# Altium schematic sheet Sheet1.SchDoc
size A3; SheetNumber: 1; SheetTotal: 1
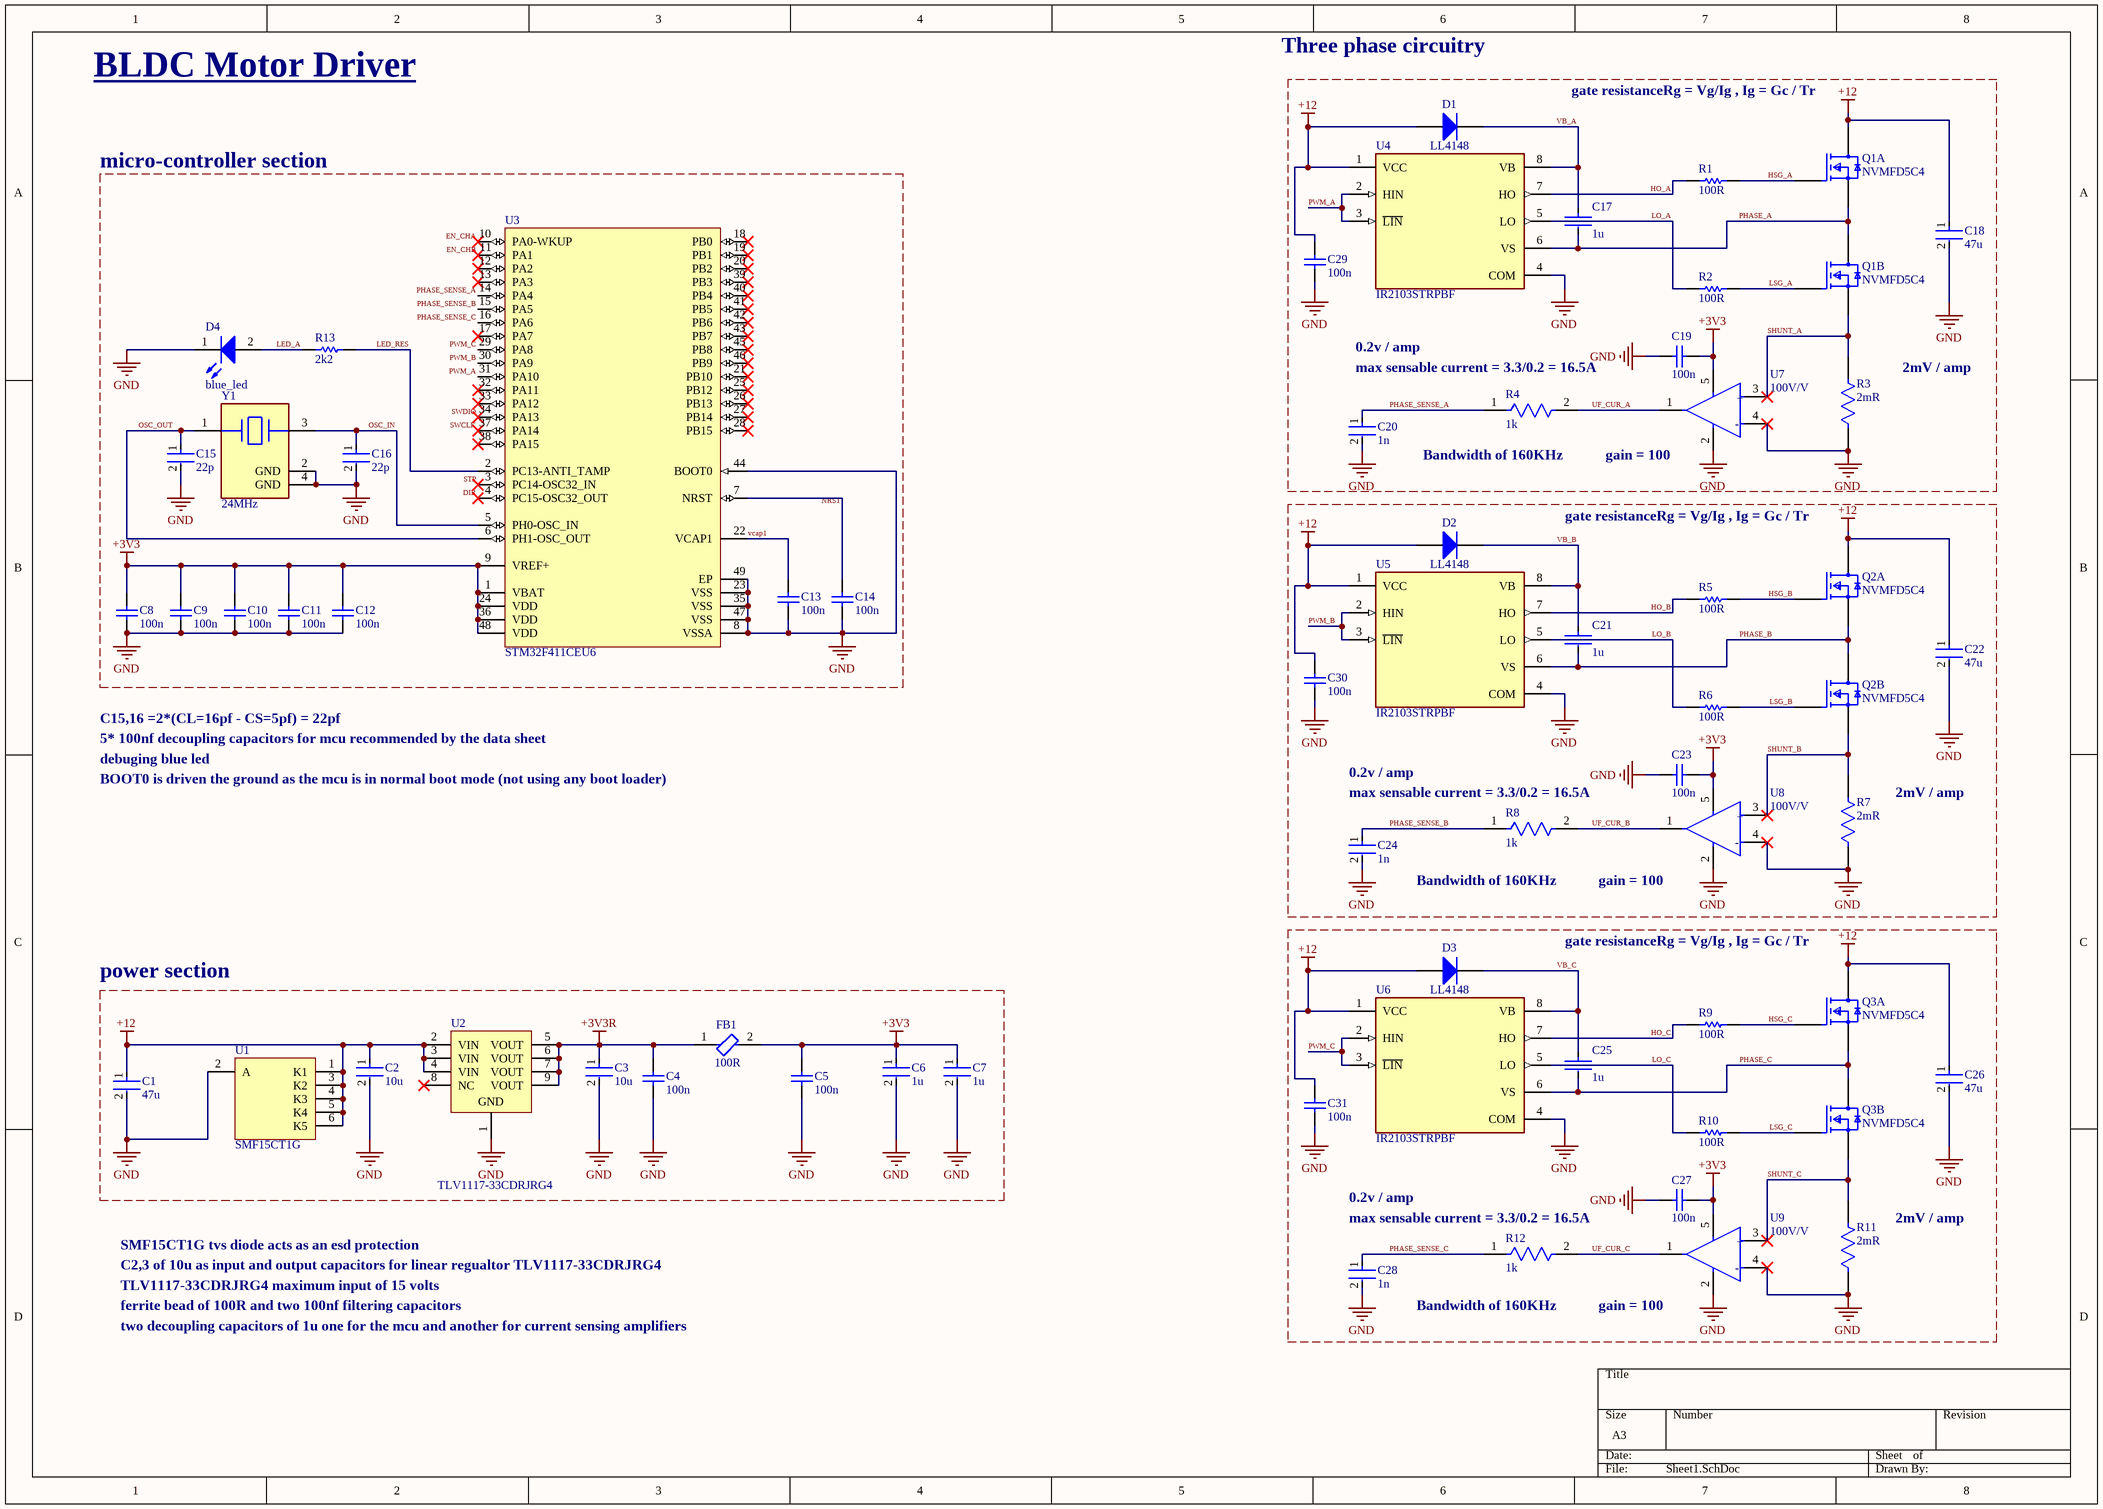
[diagram p0: Sheet1.SchDoc]

## Parts
C1  47u  [FP-C3216-160-0_2-MFG]
C2  10u  [FP-GRM21B-0_1-IPC_C]
C3  10u  [FP-GRM21B-0_1-IPC_C]
C4  100n  [CAPC1005X56X25LL10T15]
C5  100n  [CAPC1005X56X25LL10T15]
C6  1u  [FP-CC0402-MFG]
C7  1u  [FP-CC0402-MFG]
C8  100n  [CAPC1005X56X25LL10T15]
C9  100n  [CAPC1005X56X25LL10T15]
C10  100n  [CAPC1005X56X25LL10T15]
C11  100n  [CAPC1005X56X25LL10T15]
C12  100n  [CAPC1005X56X25LL10T15]
C13  100n  [CAPC1005X56X25LL10T15]
C14  100n  [CAPC1005X56X25LL10T15]
C15  22p  [FP-C0402-BB-MFG]
C16  22p  [FP-C0402-BB-MFG]
C17  1u  [FP-CC0402-MFG]
C18  47u  [FP-C3216-160-0_2-MFG]
C19  100n  [CAPC1005X56X25LL10T15]
C20  1n  [FP-GRM155-0_05-IPC_B]
C21  1u  [FP-CC0402-MFG]
C22  47u  [FP-C3216-160-0_2-MFG]
C23  100n  [CAPC1005X56X25LL10T15]
C24  1n  [FP-GRM155-0_05-IPC_B]
C25  1u  [FP-CC0402-MFG]
C26  47u  [FP-C3216-160-0_2-MFG]
C27  100n  [CAPC1005X56X25LL10T15]
C28  1n  [FP-GRM155-0_05-IPC_B]
C29  100n  [CAPC1005X56X25LL10T15]
C30  100n  [CAPC1005X56X25LL10T15]
C31  100n  [CAPC1005X56X25LL10T15]
D1  LL4148  [FAIR-SOD80-2_V]
D2  LL4148  [FAIR-SOD80-2_V]
D3  LL4148  [FAIR-SOD80-2_V]
D4  blue_led  [WL-SMCC_0402_L1W0.5H0.4]
FB1  100R  [FP-MPZ2012-MFG]
Q1  NVMFD5C4  [FP-506BT-MFG]  (parts A,B of 2)
Q2  NVMFD5C4  [FP-506BT-MFG]  (parts A,B of 2)
Q3  NVMFD5C4  [FP-506BT-MFG]  (parts A,B of 2)
R1  100R  [RESC1005X40X25ML05T10]
R2  100R  [RESC1005X40X25ML05T10]
R3  2mR  [FP-CSS2H-2512K-2L00F-MFG]
R4  1k  [FP-RC0402-0_4-IPC_A]
R5  100R  [RESC1005X40X25ML05T10]
R6  100R  [RESC1005X40X25ML05T10]
R7  2mR  [FP-CSS2H-2512K-2L00F-MFG]
R8  1k  [FP-RC0402-0_4-IPC_A]
R9  100R  [RESC1005X40X25ML05T10]
R10  100R  [RESC1005X40X25ML05T10]
R11  2mR  [FP-CSS2H-2512K-2L00F-MFG]
R12  1k  [FP-RC0402-0_4-IPC_A]
R13  2k2  [RESC1005X40X25NL5T10]
U1  SMF15CT1G  [ONSC-SC70-6-419B-02_W_V]
U2  TLV1117-33CDRJRG4  [DRJ8-3000X2200TP]
U3  STM32F411CEU6  [STM-UFQFPN48_L]
U4  IR2103STRPBF  [FP-PG-DSO-8-MFG]
U5  IR2103STRPBF  [FP-PG-DSO-8-MFG]
U6  IR2103STRPBF  [FP-PG-DSO-8-MFG]
U7  100V/V  [FP-DBV0005A-IPC_C]
U8  100V/V  [FP-DBV0005A-IPC_C]
U9  100V/V  [FP-DBV0005A-IPC_C]
Y1  24MHz  [FP-ABM3B-MFG]

## Blocks framed on the sheet
micro-controller section: C8-C16 D4 R13 U3 Y1
power section: C1-C7 FB1 U1 U2

## Nets
+3V3: C5.2 C6.1 C7.1 C8.2 C9.2 C10.2 C11.2 C12.2 C19.1 C23.1 C27.1 FB1.2 U3.1(VBAT) U3.9(VREF+) U3.24(VDD) U3.36(VDD) U3.48(VDD) U7.5(VS) U8.5(VS) U9.5(VS)
+3V3R: C3.1 C4.2 FB1.1 U2.5(VOUT) U2.6(VOUT) U2.7(VOUT) U2.9(VOUT)
+12: C1.1 C2.1 C18.1 C22.1 C26.1 C29.2 C30.2 C31.2 D1.1(A) D2.1(A) D3.1(A) Q1.7-8(D1) Q2.7-8(D1) Q3.7-8(D1) U1.1(K1) U1.3(K2) U1.4(K3) U1.5(K4) U1.6(K5) U2.2(VIN) U2.3(VIN) U2.4(VIN) U4.1(VCC) U5.1(VCC) U6.1(VCC)
GND: C1.2 C2.2 C3.2 C4.1 C5.1 C6.2 C7.2 C8.1 C9.1 C10.1 C11.1 C12.1 C13.1 C14.1 C15.2 C16.2 C18.2 C19.2 C20.2 C22.2 C23.2 C24.2 C26.2 C27.2 C28.2 C29.1 C30.1 C31.1 D4.1(K) R3.1 R7.1 R11.1 U1.2(A) U2.1(GND) U3.8(VSSA) U3.23(VSS) U3.35(VSS) U3.44(BOOT0) U3.47(VSS) U3.49(EP) U4.4(COM) U5.4(COM) U6.4(COM) U7.2(GND) U7.4(IN-) U8.2(GND) U8.4(IN-) U9.2(GND) U9.4(IN-) Y1.2(GND) Y1.4(GND)
DIR: U3.4(PC15-OSC32_OUT)
EN_CHA: U3.10(PA0-WKUP)
EN_CHB: U3.11(PA1)
HO_A: R1.1 U4.7(HO)
HO_B: R5.1 U5.7(HO)
HO_C: R9.1 U6.7(HO)
HSG_A: Q1.2(G1) R1.2
HSG_B: Q2.2(G1) R5.2
HSG_C: Q3.2(G1) R9.2
LED_A: D4.2(A) R13.1
LED_RES: R13.2 U3.2(PC13-ANTI_TAMP)
LO_A: R2.1 U4.5(LO)
LO_B: R6.1 U5.5(LO)
LO_C: R10.1 U6.5(LO)
LSG_A: Q1.4(G2) R2.2
LSG_B: Q2.4(G2) R6.2
LSG_C: Q3.4(G2) R10.2
NRST: C14.2 U3.7(NRST)
OSC_IN: C16.1 U3.5(PH0-OSC_IN) Y1.3
OSC_OUT: C15.1 U3.6(PH1-OSC_OUT) Y1.1
PHASE_A: C17.2 Q1.1(S1) Q1.5-6(D2) U4.6(VS)
PHASE_B: C21.2 Q2.1(S1) Q2.5-6(D2) U5.6(VS)
PHASE_C: C25.2 Q3.1(S1) Q3.5-6(D2) U6.6(VS)
PHASE_SENSE_A: C20.1 R4.1 U3.14(PA4)
PHASE_SENSE_B: C24.1 R8.1 U3.15(PA5)
PHASE_SENSE_C: C28.1 R12.1 U3.16(PA6)
PWM_A: U3.31(PA10) U4.2(HIN) U4.3(~{LIN})
PWM_B: U3.30(PA9) U5.2(HIN) U5.3(~{LIN})
PWM_C: U3.29(PA8) U6.2(HIN) U6.3(~{LIN})
SHUNT_A: Q1.3(S2) R3.2 U7.3(IN+)
SHUNT_B: Q2.3(S2) R7.2 U8.3(IN+)
SHUNT_C: Q3.3(S2) R11.2 U9.3(IN+)
STP: U3.3(PC14-OSC32_IN)
SWCLK: U3.37(PA14)
SWDIO: U3.34(PA13)
UF_CUR_A: R4.2 U7.1(OUT)
UF_CUR_B: R8.2 U8.1(OUT)
UF_CUR_C: R12.2 U9.1(OUT)
VB_A: C17.1 D1.2(K) U4.8(VB)
VB_B: C21.1 D2.2(K) U5.8(VB)
VB_C: C25.1 D3.2(K) U6.8(VB)
vcap1: C13.2 U3.22(VCAP1)

Not connected (* = marked no-connect by the designer): U2 8(NC)*; U3 12(PA2)* 13(PA3)* 17(PA7)* 18(PB0)* 19(PB1)* 20(PB2)* 21(PB10)* 25(PB12)* 26(PB13)* 27(PB14)* 28(PB15)* 32(PA11)* 33(PA12)* 38(PA15)* 39(PB3)* 40(PB4)* 41(PB5)* 42(PB6)* 43(PB7)* 45(PB8)* 46(PB9)*

## Notes on the sheet
- BLDC Motor Driver
- Three phase circuitry
- gate resistanceRg = Vg/Ig , Ig = Gc / Tr
- 0.2v / amp
- max sensable current = 3.3/0.2 = 16.5A
- 2mV / amp
- (near R4) Bandwidth of 160KHz
- (near U7) gain = 100
- C15,16 =2*(CL=16pf - CS=5pf) = 22pf
- 5* 100nf decoupling capacitors for mcu recommended by the data sheet
- debuging blue led
- BOOT0 is driven the ground as the mcu is in normal boot mode (not using any boot loader)
- (near R7) 2mV / amp
- Bandwidth of 160KHz
- (near U8) gain = 100
- SMF15CT1G tvs diode acts as an esd protection
- (near R11) 2mV / amp
- C2,3 of 10u as input and output capacitors for linear regualtor TLV1117-33CDRJRG4
- TLV1117-33CDRJRG4 maximum input of 15 volts
- ferrite bead of 100R and two 100nf filtering capacitors
- (near U9) gain = 100
- two decoupling capacitors of 1u one for the mcu and another for current sensing amplifiers
- (in symbol CMP-04895-000229-1) +; -

## Library data of the parts
C1 C18 C22 C26 = CMP-2000-05397-3: Multilayer Ceramic Capacitors 47uF ±20% 25V X5R SMD 1206; Weight: 0.000571oz; Dielectric: X5R; Length: 0.126inch; Voltage Rating: 25V; Case/Package: 1206; Dielectric Material: Ceramic; Min Operating Temperature: -55°C; Lead Free: Lead Free; Packaging: Tape and Reel; Package Quantity: 1; Mount: Surface Mount; Depth: 1.6mm; REACH SVHC: No SVHC; Termination: SMD/SMT; Case Code (Imperial): 1206; Series: C; Resistor Type: Ceramic; Voltage: 25V; Width: 0.063inch; Height: 1.6mm; Tolerance: 20%; Capacitance: 47uF; Max Operating Temperature: 85°C; Voltage Rating (DC): 25V; RoHS Compliant: Yes; Thickness: 0.071inch; Case Code (Metric): 3216
C2 C3 = CMP-2007-03453-2: Chip Multilayer Ceramic Capacitors for General Purpose, 0805, 10uF, X5R, 15%, 10%, 16V; Radiation Hardening: No; Thickness: 0.053inch; Voltage Rating (DC): 16V; Lead Free: Lead Free; Package Quantity: 1; Width: 1.25mm; Case Code (Imperial): 0805; Depth: 1.25mm; Packaging: Tape and Reel; Dielectric: X5R; Max Operating Temperature: 85°C; Tolerance: 10%; Voltage Rating: 16V; Voltage: 16V; Capacitance: 10uF; Height: 1.25mm; Case Code (Metric): 2012; Material: Ceramic; Mount: Surface Mount; Case/Package: 0805; REACH SVHC: No SVHC; Length: 2mm; Min Operating Temperature: -55°C; Termination: SMD/SMT
C4 C5 C8-C14 C19 C23 C27 C29-C31 = CMP-2008-02743-1: Manufacturer: AVX Interconnect / Elco; Part Number: 04026D104KAT2A
C6 C7 C17 C21 C25 = CMP-2100-03591-2: CAP CER 1UF 6.3V X5R 0402; Manufacturer: YAGEO; Manufacturer Part Number: CC0402KRX5R5BB105; Automotive Grade: NA; Material: Ceramic; Tolerance: 0.1; Temperature Coefficient: 30ppm/°C; Voltage Rating: 6.3 V; Temperature Range Low: -55°C; Digikey Description: CAP CER 1UF 6.3V X5R 0402; Capacitance: 1 uF; Height: 0.55mm; Automotive: No; ComponentLink2URL: http://www.yageo.com/documents/recent/UPY-GP_NP0_16V-to-50V_16.pdf; Device Class L2: Capacitors; RoHS: TRUE; Temperature Range High: +125°C; Device Class L3: Ceramic Capacitors; Device Class L1: Passive Components; Temperature Characteristic: X5R; Package: CC0402; Octopart: https://octopart.com/cc0402krx5r5bb105-yageo-42244618; ComponentLink2Description: Datasheet; Temperature: -55°C to +125°C; Mouser Description: Multilayer Ceramic Capacitors MLCC - SMD/SMT 1uF 6.3V X5R 10%; Category: Cap; Footprint Url: http://www.yageo.com/exep/pages/download/literatures/UPY-C_GEN_24.pdf; Lead Free: Yes; Ipc Land Pattern Name: CAPC10050X50; Value: 1 uF
C15 C16 = CMP-2008-03360-2: CAP CER 22PF 16V 5% NP0 0402; Manufacturer: Kemet; Manufacturer Part Number: C0402C220J4GACTU; Tolerance: 0.05; Temperature Coefficient: 15%; Material: Ceramic; Temperature Characteristic: C0G; RoHS: TRUE; Device Class L2: Capacitors; Digikey Description: CAP CER 22PF 16V 5% NP0 0402; Mouser Description: Multilayer Ceramic Capacitors MLCC - SMD/SMT 16volts 22pF C0G 5%; Height: 0.55mm; Ipc Land Pattern Name: CAPC10050X50; Octopart: https://octopart.com/c0402c220j4gactu-kemet-9139401; Lead Free: Yes; Category: Cap; Capacitance: 22 pF; Temperature Range High: +125°C; ComponentLink2URL: https://content.kemet.com/datasheets/KEM_C1002_X7R_SMD.pdf; Device Class L3: Ceramic Capacitors; Package: C0402-BB; Temperature: -55°C to +125°C; Automotive: No; Device Class L1: Passive Components; Voltage Rating: 16 V; Value: 22 pF; ComponentLink2Description: Datasheet; Temperature Range Low: -55°C
C20 C24 C28 = CMP-2008-04254-2: Chip Multilayer Ceramic Capacitors for General Purpose, 0402, 1000pF, C0G, 30ppm/°C, 5%, 50V; Insulation Resistance: 10GR; Capacitance: 1nF; Packaging: Tape and Reel; Lead Free: Lead Free; Tolerance: 5%; Temperature Coefficient: 30ppm/°C; Thickness: 0.022inch; Termination: SMD/SMT; Max Operating Temperature: 125°C; Height: 0.5mm; Package Quantity: 1; Radiation Hardening: No; Material: Ceramic; Case Code (Metric): 1005; Number of Pins: 2; Voltage Rating: 50V; Mount: Surface Mount; Voltage: 50V; Case/Package: 0402; Min Operating Temperature: -55°C; Dielectric Material: Ceramic; Width: 0.5mm; Depth: 0.5mm; Case Code (Imperial): 0402; REACH SVHC: No SVHC; Dielectric: C0G; Voltage Rating (DC): 50V; Length: 1mm
D1-D3 = CMP-2000-05115-2: Small Signal Diode, 100 V, 0.2 A, -55 to 175 degC, 2-Pin SOD80, RoHS, Tape and Reel; Manufacturer: Fairchild; Reverse Voltage-Max [Vrrm]: 100V; Average Forward Current-Max: 200mA; Forward Voltage: 1V; Reverse Recovery Time-Max: 1ns; Power Dissipation: 500mW; Datasheet URL: https://www.fairchildsemi.com/datasheets/LL/LL4148.pdf; Manufacturer URL: https://www.fairchildsemi.com/; Datasheet Version: Rev. 1.8, 01/2016
D4 = CMP-03913-90235556-2: WL-SMCC SMT Mono-Color Chip LED Compact; Viewing Angle: 120°; Max Reverse Voltage (DC): 5V; Luminous Intensity: 150mcd; Wavelength: 470nm; Peak Wavelength: 465nm; Forward Voltage: 3.2V; Forward Current: 60mA; Min Operating Temperature: -40°C; Width: 500µm; Length: 1mm; Packaging: Tape and Reel; RoHS: Compliant; Dominant Wavelength: 470nm; Max Operating Temperature: 85°C; Height: 400µm
FB1 = CMP-2000-05401-2: Manufacturer Lifecycle Status: PRODUCTION; NexarPartId: 12090955; RMS Current (Irms): 2A; Test Frequency: 100MHz; Tolerance: 25%; Core Material: Ferrite; Series Resistance: 100mΩ; Impedance: 600Ω; Packaging: Digi-Reel®; Length: 2mm; Min Operating Temperature: -55°C; Width: 1.25mm; Max Width: 1.45mm; Lead Free: Lead Free; Current Rating: 2A; Case Code (Imperial): 0805; Min Length: 1.8mm; Schedule B: 8504500000, 8504500000; REACH SVHC: No SVHC; Case Code (Metric): 2012; Max DC Current: 2A; Case/Package: 0805; Lifecycle Status: Production; Min Width: 1.05mm; Mount: Surface Mount; Height: 1.0414mm; Resistance: 100mΩ; DC Resistance (DCR): 100mΩ; Max Operating Temperature: 125°C; Max Length: 2.2mm; RoHS: Compliant
Q1-Q3 = CMP-00278-84330944-1: NVMFD5C470NLWFT1G Trans MOSFET Array Dual N-CH 40V 11A 8-Pin SOIC-FL T/R; Manufacturer Lifecycle Status: ACTIVE; Drain to Source Resistance: 9.2mΩ; Lifecycle Status: Production; Schedule B: 8541290080; RoHS: Compliant; NexarPartId: 84330944
R1 R2 R5 R6 R9 R10 = CMP-2002-07344-1: Part Number: RC0402FR-07100RL; Manufacturer: Yageo / Phycomp
R3 R7 R11 = CMP-00059-73869590-1: CSS2H-2512K-2L00F SMD Current Sense Resistor, 2 Milliohm, ± 1%, 5 W, 2512 [6432 Metric], Metal Strip; Max Power Dissipation: 5W; Resistance: 2mΩ; Temperature Coefficient: 50ppm/°C; REACH SVHC: No SVHC; Tolerance: 1%; Height: 508µm; Case/Package: 2512; Length: 6.35mm; Packaging: Cut Tape; Number of Terminations: 2; Power Rating: 5W; Case Code (Imperial): 2512; RoHS: Compliant; Min Operating Temperature: -55°C; NexarPartId: 73869590; Features: Moisture Resistant; Max Operating Temperature: 170°C; Composition: Metal Element; Schedule B: 8533210045, 8533210045; Case Code (Metric): 6432; Width: 3.048mm
R4 R8 R12 = CMP-2002-07472-3: RES 1K OHM 1% 1/16W 0402; Max Power Dissipation: 63mW; Resistance: 1kR; Voltage Rating (DC): 50V; Temperature Coefficient: 100ppm/°C; Power Rating: 62.5mW; Technology: THICK FILM; Size Code: 0402; Series: RC; Length: 1mm; Case/Package: 0402; Features: Moisture Resistant; Termination: SMD/SMT; Case Code (Metric): 1005; Reach SVHC Compliant: Yes; Number of Terminations: 2; Tolerance: 1%; Lead Free: Lead Free; Military Standard: Not; Resistor Type: Thick Film; Max Operating Temperature: 155°C; RoHS Compliant: Yes; Construction: Rectangular; Voltage Rating: 50V; Packaging: Tape and Reel; Height: 0.32mm; Number of Pins: 2; Resistance Tolerance: 1%; Case Code (Imperial): 0402; Depth: 0.5mm; Min Operating Temperature: -55°C; Width: 0.5mm
R13 = CMP-2002-07969-2: Chip Resistor, 2.2 KOhm, +/- 5%, 0.063 W, -55 to 155 degC, 0402 (1005 Metric), RoHS, Tape and Reel; Voltage Rating (DC): 50 V; Case\Package: 0402; Power Rating: 63 mW; Case Code (Metric): 1005; PackageDescription: 2-Pin Surface Mount Device, Body 1 x 0.5 mm; ComponentLink2URL: http://www.yageo.com/documents/recent/PYu-RC_Group_51_RoHS_L_04.pdf; PackageReference: 0402; Packaging: Tape and Reel; Width: 0.5 mm; REACH SVHC: No SVHC; Tolerance: 5%; Mount: Surface Mount; Mounting Technology: Surface Mount; RoHSCompliant: true; ComponentLink1Description: Manufacturer URL; ComponentLink2Description: Datasheet; Voltage Rating: 50 V; Min Operating Temperature: -55 degC; ComponentLink1URL: http://www.yageo.com/; Resistance: 2.2 kohm; Max Operating Temperature: 155 degC; Height: 0.35 mm; Package Quantity: 10000; Pins: 2; Length: 1 mm; Case Code (Imperial): 0402; DatasheetVersion: Rev. 4, 02/2016
U1 = CMP-1061-00156-1: 5-Line Transient Voltage Suppressor Array, 6-Pin SC70, Pb-Free, Tape and Reel; Manufacturer: On Semiconductor; Direction: Unidirectional; PPK Max (W): 100; IR Max (uA): 1; ComponentLink2URL: http://www.onsemi.com/pub_link/Collateral/SMF05C-D.PDF; ComponentLink1Description: Manufacturer URL; DatasheetVersion: Rev. 4; RoHS: Pb-Free; PackageReference: SC70-6-419B-02_W; ComponentLink3URL: http://www.onsemi.com/pub_link/Collateral/SMF05C-D.PDF; PackageVersion: Rev. W; ComponentLink1URL: http://www.onsemi.com/; ComponentLink3Description: Package Specification; Mounting Technology: Surface Mount; ComponentLink2Description: Datasheet; PartNumber: SMF15CT1G; Packing: Tape and Reel; PackageDescription: 6-Pin Small Outline Transistor, Body 2 x 1.25 mm, Pitch 0.65 mm
U2 = CMP-0324-00190-2: LDO with 4.7 to 15 V Input and 3.3 V Output, 0 to 125 degC, 8-Pin SON (DRJ), Green (RoHS & no Sb/Br); Manufacturer: Texas Instruments; Vout(Min)(V): 3.3; SubFamily: Single Output LDO; Iq(Typ)(mA): 5; Vin(Min)(V): 4.7; Iout(Max)(A): 0.8; Vin(Max)(V): 15; ComponentLink1URL: http://www.ti.com/general/docs/lit/getliterature.tsp?genericPartNumber=TLV1117-33&fileType=pdf; ComponentLink3Description: URL Link1; Eco-Plan: Green (RoHS & no Sb/Br); PartNumber: TLV1117-33CDRJRG4; PackageReference: DRJ8-3000X2200TP; PackageDescription: 8-Pin Plastic Small Outline No-Lead, 4 x 4 x 0.8 mm Body, 0.8 mm Pitch, Exposed Pad; ComponentLink2Description: Package Specification; ComponentLink2URL: http://www.ti.com/litv/pdf/mpds153b; Vout(Max)(V): 3.3; Mounting Technology: Surface Mount; PackageVersion: revC, Dec-2010; ComponentLink1Description: Datasheet; DatasheetVersion: SLVS561J; ComponentLink3URL: Samples URL:http://www.ti.com/product/tlv1117-33#samples
U3 = CMP-0243-00165-1: ARM Cortex-M4 32-bit MCU+FPU, 512 KB Flash, 128 KB RAM, 36 I/Os, 48-Pin UFQFPN, -40 to 85 degC, Tray; Operating Frequency(F) (Processor speed) (MHz): 100; FLASH Size (Prog) (kB): 512; Internal RAM Size (kB): 128; I/Os (High Current): 36; Supply Voltage(Vcc) min (V): 1.7; Package Reference: 48-Pin Ultra Thin Fine Pitch Quad Flat No-Lead, 7 x 7 x 0.6 mm Body, 0.5 mm Pitch, Exposed Pad; ComponentLink1Description: Manufacturer URL; ComponentLink1URL: http://www.st.com/; Packing: Tray; Package Description: UFQFPN48; Core: ARM Cortex-M4; ComponentLink2Description: Datasheet; ComponentLink2URL: http://www.st.com/st-web-ui/static/active/en/resource/technical/document/datasheet/DM00115249.pdf; DatasheetVersion: Rev. 6; Mounting Technology: Surface Mount
U4-U6 = CMP-32851-000120-1: IC GATE DRVR HALF-BRIDGE 8SOIC; Number of Drivers: 2; Propagation Delay: 680ns; Output Current: 360mA; Fall Time: 60ns; Channel Type: Independent; RoHS Compliant: Yes; Mount: Surface Mount; Number of Channels: 2; Package Quantity: 1; Max Operating Temperature: 150°C; Number of Pins: 8; Width: 0.157inch; Number of Outputs: 2; Height: 0.059inch; Packaging: Cut Tape; Halogen Free: Not Halogen Free; Min Operating Temperature: -40°C; Lead Free: Lead Free; Max Output Current: 360mA; Length: 0.196inch; Series: -; Case/Package: SOIC
U7-U9 = CMP-04895-000229-1: IC CURR SENSE 1 CIRCUIT SOT23-5; -3db Bandwidth: 350kHz; Input Bias Current: 100nA; Input Offset Voltage (Vos): 100uV; Operating Supply Current: 260uA; Slew Rate: 2V/µs; Number of Circuits: 1; Max Operating Temperature: 125°C; Packaging: Tape and Reel; Case/Package: SOT-23-5; Mount: Surface Mount; Min Operating Temperature: -40°C; RoHS Compliant: Yes
Y1 = CMP-1688-00008-2: Crystal 24MHz ±20ppm 18pF SMD-4 5mm x 3.2mm; ESR (Equivalent Series Resistance): 50R; Frequency Stability: 50ppm; Number of Pins: 4; Lead Free: Lead Free; Packaging: Tape and Reel; Tolerance: 20ppm; Series: ABM3B; Height: 0.043inch; Load Capacitance: 18pF; Length: 5mm; Depth: 3.2mm; Mount: Surface Mount; Resistor Type: Ceramic; Case/Package: CSMD; Termination: SMD/SMT; Width: 0.126inch; Frequency: 24MHz; Max Operating Temperature: 70°C; Frequency Tolerance: 20ppm; REACH SVHC: No SVHC; Package Quantity: 1000; Min Operating Temperature: -20°C; Series Resistance: 50R; Operating Frequency: 24 MHz